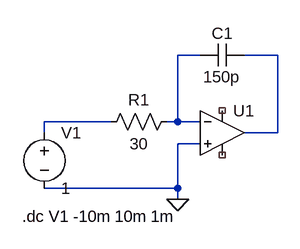
[diagram p0: schematic pruebaAO.asc]
pruebaAO.asc, the LTspice schematic file:
Version 4
SHEET 1 880 680
WIRE 192 64 160 64
WIRE 304 64 256 64
WIRE 64 160 -32 160
WIRE 160 160 160 64
WIRE 160 160 144 160
WIRE 192 160 160 160
WIRE -32 176 -32 160
WIRE 304 176 304 64
WIRE 304 176 256 176
WIRE 192 192 160 192
WIRE 160 256 160 192
WIRE 160 256 -32 256
WIRE 160 272 160 256
FLAG 160 272 0
SYMBOL OpAmps\\UniversalOpAmp2 224 176 R0
SYMATTR InstName U1
SYMBOL res 160 144 R90
WINDOW 0 0 56 VBottom 2
WINDOW 3 32 56 VTop 2
SYMATTR InstName R1
SYMATTR Value 30
SYMBOL cap 256 48 R90
WINDOW 0 0 32 VBottom 2
WINDOW 3 32 32 VTop 2
SYMATTR InstName C1
SYMATTR Value 150p
SYMBOL voltage -32 160 R0
WINDOW 123 0 0 Left 0
WINDOW 39 0 0 Left 0
SYMATTR InstName V1
SYMATTR Value 1
TEXT -64 296 Left 2 !.dc V1 -10m 10m 1m

The netlist it stands for:
* pruebaAO.asc
XU1 0 N001 NC_01 NC_02 N002 level2 Avol=1Meg GBW=10Meg Slew=10Meg Ilimit=25m Rail=0 Vos=0 En=0 Enk=0 In=0 Ink=0 Rin=500Meg  ; pins In+ In- V+ V- OUT
R1 N001 N003 30
C1 N002 N001 150p
V1 N003 0 1
.dc V1 -10m 10m 1m
.lib UniversalOpAmp2.lib
.backanno
.end